# Altium project RX_test_01.PrjPcb (part 3 of 5)

## Sheet IF 2.SchDoc
size A3; SheetNumber: 6; SheetTotal: 13
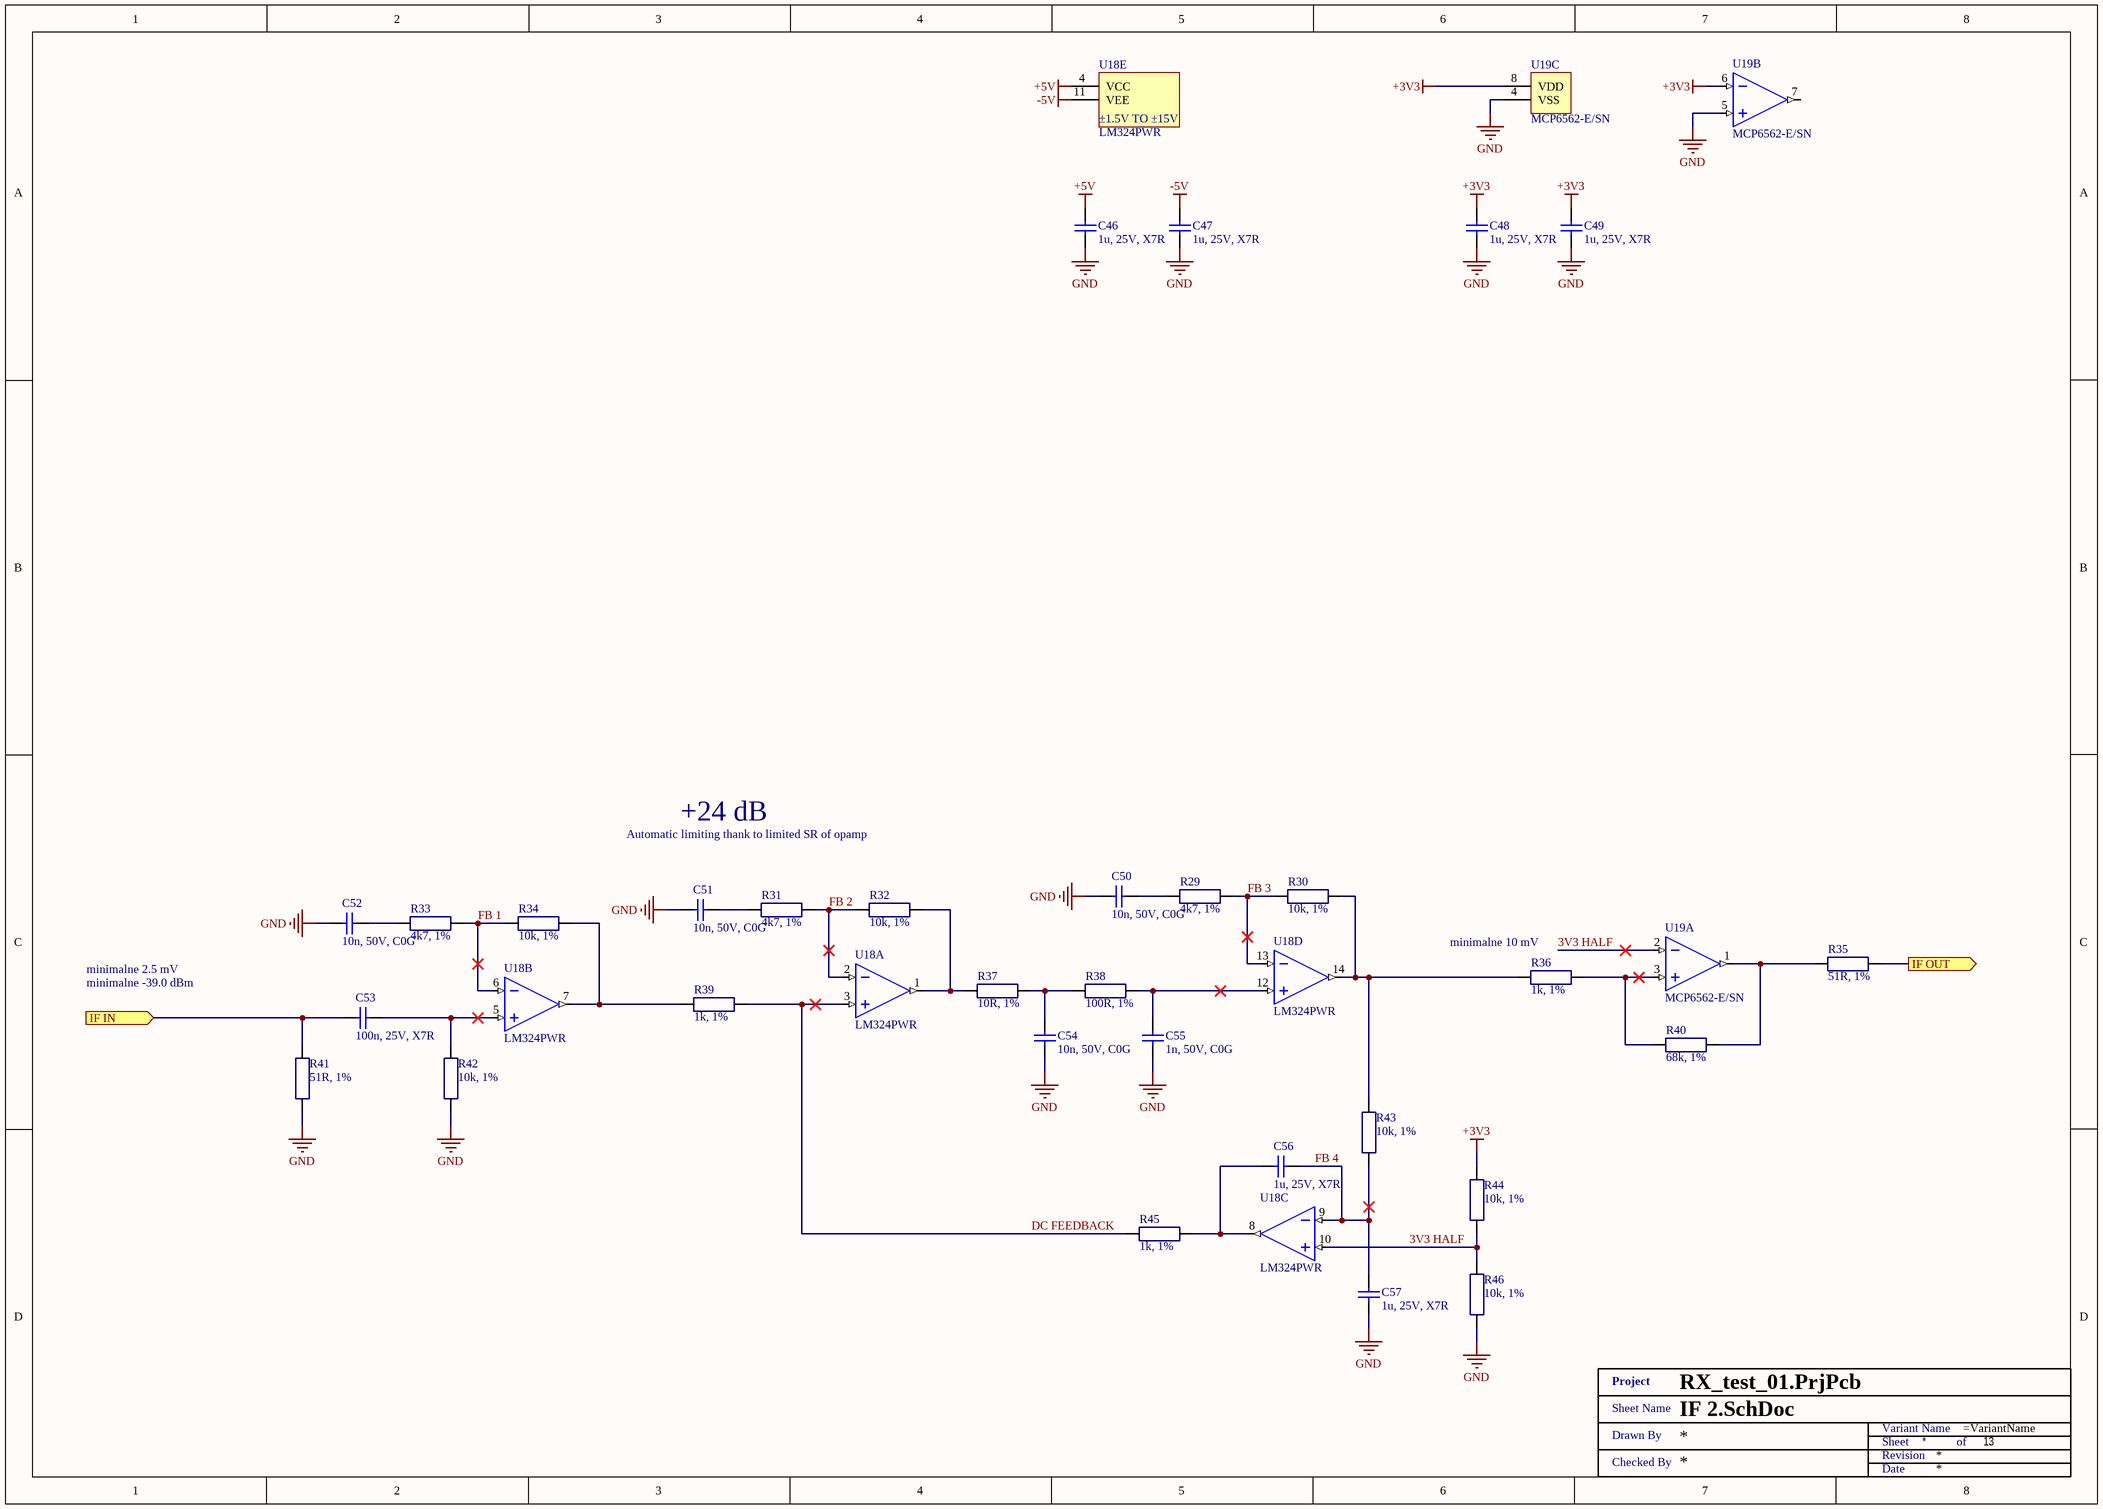
[diagram p5: IF 2.SchDoc]

### Parts
(Parts that share a designator on the sheet are numbered #1, #2 ... from top to bottom, then left to right.)
C46  1u, 25V, X7R  [SMD0603]
C47  1u, 25V, X7R  [SMD0603]
C48  1u, 25V, X7R  [SMD0603]
C49  1u, 25V, X7R  [SMD0603]
C50  10n, 50V, C0G  [SMD0603]
C51  10n, 50V, C0G  [SMD0603]
C52  10n, 50V, C0G  [SMD0603]
C53  100n, 25V, X7R  [SMD0603]
C54  10n, 50V, C0G  [SMD0603]
C55  1n, 50V, C0G  [SMD0603]
C56  1u, 25V, X7R  [SMD0603]
C57  1u, 25V, X7R  [SMD0603]
R29  4k7, 1%  [SMD0603 - R]
R30  10k, 1%  [SMD0603 - R]
R31  4k7, 1%  [SMD0603 - R]
R32  10k, 1%  [SMD0603 - R]
R33  4k7, 1%  [SMD0603 - R]
R34  10k, 1%  [SMD0603 - R]
R35  51R, 1%  [SMD0603 - R]
R36  1k, 1%  [SMD0603 - R]
R37  10R, 1%  [SMD0603 - R]
R38  100R, 1%  [SMD0603 - R]
R39  1k, 1%  [SMD0603 - R]
R40  68k, 1%  [SMD0603 - R]
R41  51R, 1%  [SMD0603 - R]
R42  10k, 1%  [SMD0603 - R]
R43  10k, 1%  [SMD0603 - R]
R44  10k, 1%  [SMD0603 - R]
R45  1k, 1%  [SMD0603 - R]
R46  10k, 1%  [SMD0603 - R]
U18  LM324PWR  [TSSOP14]  (parts A,B,C,D,E of 5)
U19  MCP6562-E/SN  [SOIC08]  (parts A,B,C of 3)
XX?#6  Title 1  (value not drawn)  (graphical)

### Ports
IF IN (in), IF OUT (out)

### Nets
+3V3: C48.2 C49.2 R44.2 U19.6(INB-) U19.8(VDD)
+5V: C46.2 U18.4(VCC)
-5V: C47.2 U18.11(VEE)
GND: C46.1 C47.1 C48.1 C49.1 C50.1 C51.1 C52.1 C54.1 C55.1 C57.1 R41.1 R42.1 R46.1 U19.4(VSS) U19.5(INB+)
3V3 HALF: R44.1 R46.2 U18.10(+IN_C) U19.2(INA-)
DC FEEDBACK: R39.2 R45.1 U18.3(+IN_A)
FB 1: R33.2 R34.1 U18.6(-IN_B)
FB 2: R31.2 R32.1 U18.2(-IN_A)
FB 3: R29.2 R30.1 U18.13(-IN_D)
FB 4: C56.1 C57.2 R43.1 U18.9(-IN_C)
NetC50_2: C50.2 R29.1
NetC51_2: C51.2 R31.1
NetC52_2: C52.2 R33.1
NetC53_1: C53.1 R41.2 ; port IF IN
NetC53_2: C53.2 R42.2 U18.5(+IN_B)
NetC54_2: C54.2 R37.2 R38.1
NetC55_2: C55.2 R38.2 U18.12(+IN_D)
NetC56_2: C56.2 R45.2 U18.8(OUT_C)
NetJ14_2: R35.2 ; port IF OUT
NetR30_2: R30.2 R36.1 R43.2 U18.14(OUT_D)
NetR32_2: R32.2 R37.1 U18.1(OUT_A)
NetR34_2: R34.2 R39.1 U18.7(OUT_B)
NetR35_1: R35.1 R40.2 U19.1(OUTA)
NetR36_2: R36.2 R40.1 U19.3(INA+)

Not connected (* = marked no-connect by the designer): U19 7(OUTB)

### Notes on the sheet
- Automatic limiting thank to limited SR of opamp
- +24 dB
- minimalne 2.5 mV
- minimalne -39.0 dBm
- (near R36) minimalne 10 mV
- (in symbol LM324PWR, part E) ±1.5V TO ±15V
- (in symbol Title 1) Project; Sheet Name; Variant Name; Drawn By; Sheet; of; Revision; Checked By; Date

### Library data of the parts
C46-C49 C56 C57 = CGA3E1X7R1E105K080AC: CAP CER 1UF 25V X7R 0603; Manufacturer: TDK Corporation; Tolerance: ±10%; Manufacturer Part Number: CGA3E1X7R1E105K080AC; RoHS: RoHS Compliant; Category: Capacitors; Stock 1: 109509; Pricing 1: 1=0.2, 10=0.135, 100=0.0686, 500=0.04696, 1000=0.04154 (USD); Packaging: Cut Tape (CT); Part Status: Active; Voltage - Rated: 25V; Temperature Coefficient: X7R; Operating Temperature: -55°C ~ 125°C; Features: -; Ratings: AEC-Q200; Applications: Automotive; Failure Rate: -; Mounting Type: Surface Mount, MLCC; Package / Case: 0603 (1608 Metric); Size / Dimension: 0.063" L x 0.032" W (1.60mm x 0.80mm); Height - Seated (Max): -; Thickness (Max): 0.035" (0.90mm); Lead Spacing: -; Lead Style: -; ComponentLink1URL: https://product.tdk.com/info/en/catalog/datasheets/mlcc_automotive_general_en.pdf; ComponentLink1Description: https://product.tdk.com/info/en/catalog/datasheets/mlcc_automotive_general_en.pdf; Capacitance: 1u; Supplier 1: Mouser; Supplier Part Number 1: 810-CGA3E1X7R1E105K; Supplier 2: Farnell; Supplier Part Number 2: 2346962; Supplier 3: Digi-Key; Supplier Part Number 3: 445-6931-1-ND
C50-C52 C54 = GRM1885C1H103JA01D: Multilayer Ceramic Capacitors MLCC - SMD/SMT 0603 50VDC 10000pF 5% C0G; Manufacturer: Murata Electronics; Type: Chip Multilayer Ceramic Capacitor for General Purpose; Capacitance - nF: 10 nF; Class: Class 1; CNHTS: 8532241000; Dielectric: C0G (NP0); TARIC: 8532240000; Supplier 1: Mouser; Supplier Part Number 1: 81-GRM1885C1H103JA1D; Manufacturer Part Number: GRM1885C1H103JA01D; RoHS: RoHS Compliant; Category: Multilayer Ceramic Capacitors MLCC - SMD/SMT; Stock 1: 217291; Pricing 1: 1=0.183, 10=0.129, 100=0.065, 500=0.045, 1000=0.039, 4000=0.030, 8000=0.027, 24000=0.025 (EUR); Capacitance: 10n; Height: 0.8 mm; Length: 1.6 mm; Package / Case: 0603 (1608 metric); Packaging: Cut Tape; Product: General Type MLCCs; Series: GRM; Termination Style: SMD/SMT; Tolerance: 5 %; Voltage Rating DC: 50 VDC; Width: 0.8 mm; Brand: Murata Electronics; Capacitance - pF: 10000 pF; Case Code - in: 0603; Case Code - mm: 1608; HTS Code: 8532240020; Maximum Operating Temperature: + 125 C; Minimum Operating Temperature: - 55 C; Product Type: Ceramic Capacitors; Standard Pack Qty: 4000; Subcategory: Capacitors; Termination: Standard; RoHS - Mouser: Y; Minimum Order Quantity: 1; Reeling: True; ComponentLink1URL: http://www.mouser.com/datasheet/2/281/murata_03052018_GRM_Series_1-1310166.pdf; ComponentLink1Description: http://www.mouser.com/datasheet/2/281/murata_03052018_GRM_Series_1-1310166.pdf; Supplier 2: Farnell; Supplier Part Number 2: 2456107
C53 = 06033C104KAT2A: AVX - 06033C104KAT2A - CAP, MLCC, X7R, 0.1UF, 25V, 0603; Ceramic Capacitor Case: 0603 [1608 Metric]; Voltage Rating: 25; Capacitance Tolerance: ± 10%; Dielectric Characteristic: X7; Product Range: AVX 0603 MLCC; SVHC: No SVHC (17-Dec-2015)<!--FANDB--><div class="features-and-benefits-container"><div class="features-and-benefits-desc-container"><span class="features-and-benefits-container-desc">SMD Multilayer Ceramic Capacitor, 0603 [1608 Metric], 0.1 µF, 25 V, ± 10%, X7R, AVX 0603 MLCC</span></div><div class="features-and-benefits-description"><span class="features-benefits-value">The 06033C104KAT2A is a SMD Multilayer Ceramic Capacitor with Ni/Sn-plated termination, X7R dielectric and 0603 case. X7R formulations are called temperature stable ceramics and fall into EIA class II materials. X7R is the most popular of this intermediate dielectric constant material. This capacitance change is non-linear. Capacitance for X7R varies under the influence of electrical operating conditions such as voltage and frequency. X7; Supplier 1: Farnell; Supplier Part Number 1: 2530141; Manufacturer: AVX; Manufacturer Part Number: 06033C104KAT2A; RoHS: YES; Stock 1: 22809; Pricing 1: 10=0.012, 100=0.0096, 500=0.0069, 1000=0.006, 2000=0.0048, 4000=0.0038, 20000=0.0027, 40000=0.0026 (GBP); Capacitance: 100n; Packaging: Cut Tape; Operating Temperature Min: -55; Operating Temperature Max: 125; Automotive Qualification Standard: -; MSL: MSL 1 - Unlimited; ComponentLink1URL: http://www.farnell.com/datasheets/2237835.pdf; ComponentLink1Description: http://www.farnell.com/datasheets/2237835.pdf; Supplier 2: Digi-Key; Supplier Part Number 2: 478-3714-1-ND
C55 = MCU0603C102JCT: MULTICOMP - MCU0603C102JCT - CAP, MLCC, C0G/NP0, 1NF, 50V, 0603; Ceramic Capacitor Case: 0603 [1608 Metric]; Voltage Rating: 50; Capacitance Tolerance: ± 5%; Product Range: MCU Series; SVHC: No SVHC (07-Jul-2017); Capacitance Tolerance +: 5%; Capacitor Terminals: SMD; External Depth: 0.8; External Length / Height: 1.6; No. of Pins: 2; Reel Quantity: 4000; Temperature Coefficient: 0ppm/°C ± 30; Voltage Rating V DC: 50V<!--FANDB--><div class="features-and-benefits-container"><div class="features-and-benefits-desc-container"><span class="features-and-benefits-container-desc">SMD Multilayer Ceramic Capacitor, 0603 [1608 Metric], 1000 pF, 50 V, ± 5%, C0G / NP0; Supplier 1: Farnell; Supplier Part Number 1: 9406131; Manufacturer: MULTICOMP; Manufacturer Part Number: MCU0603C102JCT; RoHS: YES; Stock 1: 25831; Pricing 1: 10=0.0164, 100=0.0133, 500=0.0095, 1000=0.0082, 2000=0.0065 (GBP); Capacitance: 1n; Dielectric Characteristic: C0G / NP0; Packaging: Cut Tape; Operating Temperature Min: -55; Operating Temperature Max: 125; Automotive Qualification Standard: -; MSL: -; Capacitance Tolerance ±: ± 5%; External Width: 0.8; Operating Temperature Range: -55°C to +125; Tape Width: 8; Tolerance +: 5%; Tolerance -: 5%; ComponentLink1URL: http://www.farnell.com/datasheets/1723231.pdf; ComponentLink1Description: http://www.farnell.com/datasheets/1723231.pdf
R29 R31 R33 = AC0603FR-074K7L: RES SMD 4.7K OHM 1% 1/10W 0603; Manufacturer: Yageo; Power (Watts): 0.1W, 1/10W; Temperature Coefficient: ±100ppm/°C; Manufacturer Part Number: AC0603FR-074K7L; RoHS: RoHS Compliant; Category: Resistors; Stock 1: 391581; Pricing 1: 1=0.1, 10=0.025, 100=0.01, 1000=0.00448, 2500=0.00389 (USD); Packaging: Cut Tape (CT); Part Status: Active; Tolerance: ±1%; Composition: Thick Film; Features: Automotive AEC-Q200, Moisture Resistant; Operating Temperature: -55°C ~ 155°C; Package / Case: 0603 (1608 Metric); Supplier Device Package: 0603; Size / Dimension: 0.063" L x 0.032" W (1.60mm x 0.80mm); Height - Seated (Max): 0.022" (0.55mm); Failure Rate: -; ComponentLink1URL: http://www.yageo.com/NewPortal/yageodocoutput?fileName=/pdf/R-Chip/PYu-AC_51_RoHS_L_6.pdf; ComponentLink1Description: http://www.yageo.com/NewPortal/yageodocoutput?fileName=/pdf/R-Chip/PYu-AC_51_RoHS_L_6.pdf; Resistance: 4k7; Supplier 1: Mouser; Supplier Part Number 1: 603-AC0603FR-074K7L; Supplier 2: Digi-Key; Supplier Part Number 2: YAG3613CT-ND; Supplier 3: Future Electronics; Supplier Part Number 3: AC0603FR-074K7L-CUTT
R30 R32 R34 R42-R44 R46 = RC0603FR-0710KL: YAGEO (PHYCOMP) - RC0603FR-0710KL - RES, THICK FILM, 10K, 1%, 0.1W, 0603; Voltage Rating: 50; Resistor Case Style: 0603 [1608 Metric]; Power Rating: 100; Product Range: RC Series; Temperature Coefficient: ± 100; SVHC: No SVHC (20-Jun-2016); Manufacturer: YAGEO (PHYCOMP); Manufacturer Part Number: RC0603FR-0710KL; RoHS: YES; Stock 1: 9995; Pricing 1: 5000=0.0025, 25000=0.0014, 50000=0.0013 (GBP); Resistance: 10k; Resistance Tolerance: ± 1%; Packaging: Tape & Reel; Resistor Element Material: Thick Film; Automotive Qualification Standard: -; MSL: MSL 1 - Unlimited<!--FANDB--><div class="features-and-benefits-container"><div class="features-and-benefits-desc-container"><span class="features-and-benefits-container-desc">SMD Chip Resistor, Thick Film, 10 kohm, 50 V, 0603 [1608 Metric], 100 mW, ± 1; ComponentLink1URL: http://past.yageo.com/pdf/PYu-R_Packing_6.pdf; ComponentLink1Description: http://past.yageo.com/pdf/PYu-R_Packing_6.pdf; ComponentLink2URL: http://www.farnell.com/datasheets/2167052.pdf; ComponentLink2Description: http://www.farnell.com/datasheets/2167052.pdf; Supplier 1: Mouser; Supplier Part Number 1: 603-RC0603FR-0710KL; Supplier 2: Farnell; Supplier Part Number 2: 2421850; Supplier 3: Digi-Key; Supplier Part Number 3: 311-10.0KHRCT-ND
R35 R41 = CRCW060351R0FKEA: RES SMD 51 OHM 1% 1/10W 0603; Manufacturer: Vishay Dale; Power (Watts): 0.1W, 1/10W; Temperature Coefficient: ±100ppm/°C; Manufacturer Part Number: CRCW060351R0FKEA; RoHS: RoHS Compliant; Category: Resistors; Stock 1: 21691; Pricing 1: 1=0.1, 10=0.042, 100=0.017, 1000=0.00764, 2500=0.00663 (USD); Packaging: Cut Tape (CT); Part Status: Active; Tolerance: ±1%; Composition: Thick Film; Features: Automotive AEC-Q200; Operating Temperature: -55°C ~ 155°C; Package / Case: 0603 (1608 Metric); Supplier Device Package: 0603; Size / Dimension: 0.063" L x 0.033" W (1.60mm x 0.85mm); Height - Seated (Max): 0.020" (0.50mm); Failure Rate: -; ComponentLink1URL: http://www.vishay.com/docs/20035/dcrcwe3.pdf; ComponentLink1Description: http://www.vishay.com/docs/20035/dcrcwe3.pdf; Resistance: 51R; Supplier 1: Mouser; Supplier Part Number 1: 71-CRCW0603-51-E3; Supplier 2: Farnell; Supplier Part Number 2: 1652889; Supplier 3: Digi-Key; Supplier Part Number 3: 541-51.0HCT-ND
R36 R39 R45 = MCWR06X1001FTL: MULTICOMP - MCWR06X1001FTL - RES, THICK FILM, 1K, 1%, 0.1W, 0603; Voltage Rating: 50; Resistor Case Style: 0603 [1608 Metric]; Power Rating: 100; Product Range: MCWR Series; Temperature Coefficient: ± 100; SVHC: No SVHC (07-Jul-2017)<!--FANDB--><div class="features-and-benefits-container"><div class="features-and-benefits-desc-container"><span class="features-and-benefits-container-desc">SMD Chip Resistor, Thick Film, 1 kohm, 50 V, 0603 [1608 Metric], 100 mW, ± 1; Manufacturer: MULTICOMP; Manufacturer Part Number: MCWR06X1001FTL; RoHS: Y-EX; Stock 1: 134740; Pricing 1: 10=0.0037, 100=0.0022, 500=0.0016, 1000=0.0012, 2500=0.001 (GBP); Resistance: 1k; Resistance Tolerance: ± 1%; Packaging: Cut Tape; Resistor Element Material: Thick Film; Automotive Qualification Standard: -; ComponentLink1URL: http://www.farnell.com/datasheets/1849611.pdf; ComponentLink1Description: http://www.farnell.com/datasheets/1849611.pdf; Supplier 1: Farnell; Supplier Part Number 1: 2447272; Supplier 2: Newark; Supplier Part Number 2: 94X1378
R37 = CRCW060310R0FKEAC: D11/CRCW0603-C 100 10R 1%; Manufacturer: Vishay Dale; Power (Watts): 0.1W, 1/10W; Temperature Coefficient: ±100ppm/°C; Manufacturer Part Number: CRCW060310R0FKEAC; RoHS: RoHS Compliant; Category: Resistors; Stock 1: 49728; Pricing 1: 1=0.1, 10=0.027, 100=0.0108, 1000=0.00487, 2500=0.00422 (USD); Packaging: Cut Tape (CT); Part Status: Active; Tolerance: ±1%; Composition: Thick Film; Features: -; Operating Temperature: -55°C ~ 155°C; Package / Case: 0603 (1608 Metric); Supplier Device Package: 0603; Height - Seated (Max): 0.022" (0.55mm); Failure Rate: -; ComponentLink1URL: http://www.vishay.com/docs/28773/crcwce3.pdf; ComponentLink1Description: http://www.vishay.com/docs/28773/crcwce3.pdf; Resistance: 10R; Supplier 1: Mouser; Supplier Part Number 1: 71-CRCW060310R0FKEAC; Supplier 2: Digi-Key; Supplier Part Number 2: 541-3952-1-ND
R38 = MCWR06X1000FTL: MULTICOMP - MCWR06X1000FTL - RES, THICK FILM, 100R, 1%, 0.1W, 0603; Voltage Rating: 50; Resistor Case Style: 0603 [1608 Metric]; Power Rating: 100; Product Range: MCWR Series; Temperature Coefficient: ± 100; SVHC: No SVHC (07-Jul-2017)<!--FANDB--><div class="features-and-benefits-container"><div class="features-and-benefits-desc-container"><span class="features-and-benefits-container-desc">SMD Chip Resistor, Thick Film, 100 ohm, 50 V, 0603 [1608 Metric], 100 mW, ± 1%, MCWR Series</span></div><div class="features-and-benefits-description"><span class="features-benefits-value">The MCWR06X1000FTL is a thick film Chip Resistor with 0603 chip format. The resistor is constructed in a high grade ceramic body (aluminium oxide). Internal metal electrodes are added at each end and connected by a resistive paste that is applied to the top surface of the substrate. The composition of the paste is adjusted to give the approximate resistance required and the value is trimmed to within tolerance by laser cutting of this resistive layer.</span></div><div class="features-and-benefits-list"><ul class="features-and-benefits-list-list"><li class="features-and-benefits-list-item">High reliability and stability</li><li class="features-and-benefits-list-item">Reduced size of final equipment</li><li class="features-and-benefits-list-item">Lower assembly costs</li><li class="features-and-benefits-list-item">Higher component and equipment reliability</li></ul></div><div class="features-and-benefits-applications"><ul class="features-and-benefits-value"><li class="features-and-benefits-list-item">Consumer Electronics</li><li class="features-and-benefits-list-item">Computers & Computer Peripherals</li><li class="features-and-benefits-list-item">Communications & Networking</li></ul></div></div>; Supplier 1: Farnell; Supplier Part Number 1: 2447227; Manufacturer: MULTICOMP; Manufacturer Part Number: MCWR06X1000FTL; RoHS: Y-EX; Stock 1: 246691; Pricing 1: 10=0.0032, 100=0.002, 500=0.0013, 1000=0.0011, 2500=0.0009 (GBP); Resistance: 100R; Resistance Tolerance: ± 1%; Packaging: Cut Tape; Resistor Element Material: Thick Film; Automotive Qualification Standard: -; ComponentLink1URL: http://www.farnell.com/datasheets/1849611.pdf; ComponentLink1Description: http://www.farnell.com/datasheets/1849611.pdf
R40 = RC0603FR-0768KL: RES SMD 68K OHM 1% 1/10W 0603; Manufacturer: Yageo; Power (Watts): 0.1W, 1/10W; Temperature Coefficient: ±100ppm/°C; Manufacturer Part Number: RC0603FR-0768KL; RoHS: RoHS Compliant; Category: Resistors; Stock 1: 1240858; Pricing 1: 1=0.1, 10=0.015, 100=0.006, 1000=0.00268, 2500=0.00233 (USD); Packaging: Cut Tape (CT); Part Status: Active; Tolerance: ±1%; Composition: Thick Film; Features: Moisture Resistant; Operating Temperature: -55°C ~ 155°C; Package / Case: 0603 (1608 Metric); Supplier Device Package: 0603; Size / Dimension: 0.063" L x 0.032" W (1.60mm x 0.80mm); Height - Seated (Max): 0.022" (0.55mm); Failure Rate: -; ComponentLink1URL: http://www.yageo.com/documents/recent/PYu-RC_Group_51_RoHS_L_8.pdf; ComponentLink1Description: http://www.yageo.com/documents/recent/PYu-RC_Group_51_RoHS_L_8.pdf; Resistance: 68k; Supplier 1: Mouser; Supplier Part Number 1: 603-RC0603FR-0768KL; Supplier 2: Farnell; Supplier Part Number 2: 9238700; Supplier 3: Digi-Key; Supplier Part Number 3: 311-68.0KHRCT-ND
U18 = LM324PWR: OP-AMP, 1.2MHZ, 0.5V/ US, TSSOP-14; Manufacturer: TEXAS INSTRUMENTS; Bandwidth: 1.2; No. of Amplifiers: 4; Slew Rate: 0.5; Supply Voltage Range: ± 1.5V to ± 16; Amplifier Case Style: TSSOP; No. of Pins: 14; SVHC: No SVHC (17-Dec-2014); Filter Terminals: SMD; Input Bias Current: 250000; Op Amp Type: High Gain; Output Current: 20; Quiescent Current: 0.3; Supply Voltage Max: 32; Supply Voltage Min: 3; Parameter 1: Jellybean; Manufacturer Part Number: LM324PWR; RoHS: YES; Stock 1: 1889; Pricing 1: 5=0,171, 50=0,15, 250=0,126, 500=0,125, 1000=0,125 (EUR); Operating Temperature Min: 0; Operating Temperature Max: 70; Packaging: Cut Tape; MSL: MSL 1 - Unlimited; Amplifer Supply Voltage: ± 1.5V to ± 16; Operating Temperature Range: 0°C to +70; ComponentLink1URL: http://www.farnell.com/datasheets/1877076.pdf; ComponentLink1Description: http://www.farnell.com/datasheets/1877076.pdf; Stock 3: 1204; Pricing 3: 1=0,24, 10=0,23, 100=0,23, 250=0,22, 500=0,21, 1000=0,21, 3000=0,171, 10000=0,157 (EUR); ComponentLink2URL: http://www.farnell.com/datasheets/378369.pdf; ComponentLink2Description: http://www.farnell.com/datasheets/378369.pdf; Supplier 1: Mouser; Supplier 2: Farnell; Supplier Part Number 2: 2342289; Supplier Part Number 1: 595-LM324PWR
U19 = MCP6562-E/SN: Microchip MCP6562-E/SN Dual Comparator, Push-Pull O/P, 3 V, 5 V 8-Pin SOIC; Max Supply Voltage: 5.5V; Min Supply Voltage: 1.8V; Common Mode Rejection Ratio: 66dB; Number of Channels: 2; Nominal Supply Current: 130uA; Propagation Delay: 80ns; Input Offset Voltage (Vos): 10mV; Input Bias Current: 1pA; Output Current: 50mA; Hysteresis: 5mV; Turn-On Delay Time: 45ns; Power Supply Rejection Ratio (PSRR): 70dB; Natural Thermal Resistance: 163°C/W; Response Time: 49ns; Output Type: TTL,PUSH-PULL; Supplier 1: Mouser; Supplier Part Number 1: 579-MCP6562-E/SN; Manufacturer: Microchip; Manufacturer Part Number: MCP6562-E/SN; RoHS: Yes; Category: Comparators; Stock 1: 2727; Pricing 1: 1=0.85000, 10=0.84800, 25=0.71100, 50=0.71100, 100=0.65900, 1000=0.65900, 10000=0.65900 (USD); Mount: Surface Mount; Case/Package: SOIC; Number of Pins: 8; Min Operating Temperature: -40°C; Max Operating Temperature: 125°C; Packaging: Rail/Tube; Number of Elements: 2; Package Quantity: 100; Quiescent Current: 130uA; Max Supply Current: 130uA; Type: General Purpose; Supply Current: 130uA; Technology: CMOS; Length: 4.9mm; Width: 3.9mm; Height: 1.25mm; Radiation Hardening: No; REACH SVHC: No SVHC; Lead Free: Lead Free; RoHS Compliant: Yes; ComponentLink1URL: https://datasheet.ciiva.com/1576/22139b-1576720.pdf?src-supplier=Newark; ComponentLink1Description: https://datasheet.ciiva.com/1576/22139b-1576720.pdf?src-supplier=Newark; ComponentLink2URL: https://datasheet.ciiva.com/15131/getdatasheetpartid-771954-15131482.pdf?src-supplier=Verical; ComponentLink2Description: https://datasheet.ciiva.com/15131/getdatasheetpartid-771954-15131482.pdf?src-supplier=Verical; ComponentLink3URL: https://datasheet.ciiva.com/26344/651517-da-01-en-ic-comp-mcp6562-e-sn-soic-8n-mcp-26344456.pdf?src-supplier=Conrad; ComponentLink3Description: https://datasheet.ciiva.com/26344/651517-da-01-en-ic-comp-mcp6562-e-sn-soic-8n-mcp-26344456.pdf?src-supplier=Conrad; ComponentLink4URL: https://datasheet.ciiva.com/1483/630456-1483745.pdf?src-supplier=Element14; ComponentLink4Description: https://datasheet.ciiva.com/1483/630456-1483745.pdf?src-supplier=Element14; ComponentLink5URL: https://datasheet.ciiva.com/2971/jp540574-2971157.pdf?src-supplier=Avnet; ComponentLink5Description: https://datasheet.ciiva.com/2971/jp540574-2971157.pdf?src-supplier=Avnet; ComponentLink6URL: https://datasheet.ciiva.com/16450/filehandler-aspxddocname-en540574-16450650.pdf?src-supplier=Future+Electronics; ComponentLink6Description: https://datasheet.ciiva.com/16450/filehandler-aspxddocname-en540574-16450650.pdf?src-supplier=Future+Electronics; ComponentLink7URL: https://datasheet.ciiva.com/1828/22139b-1828444.pdf?src-supplier=Digi-Key; ComponentLink7Description: https://datasheet.ciiva.com/1828/22139b-1828444.pdf?src-supplier=Digi-Key; ComponentLink8URL: https://datasheet.ciiva.com/17548/jp540574-17548718.pdf?src-supplier=Avnet+Europe; ComponentLink8Description: https://datasheet.ciiva.com/17548/jp540574-17548718.pdf?src-supplier=Avnet+Europe; ComponentLink9URL: https://datasheet.ciiva.com/12288/22139a-12288079.pdf?src-supplier=Mouser; ComponentLink9Description: https://datasheet.ciiva.com/12288/22139a-12288079.pdf?src-supplier=Mouser; Supplier 2: Farnell; Supplier Part Number 2: 1715875; Supplier 3: RSComponents; Supplier Part Number 3: 6696275

## Sheet DETECTOR.SchDoc
size A4; SheetNumber: 7; SheetTotal: 13
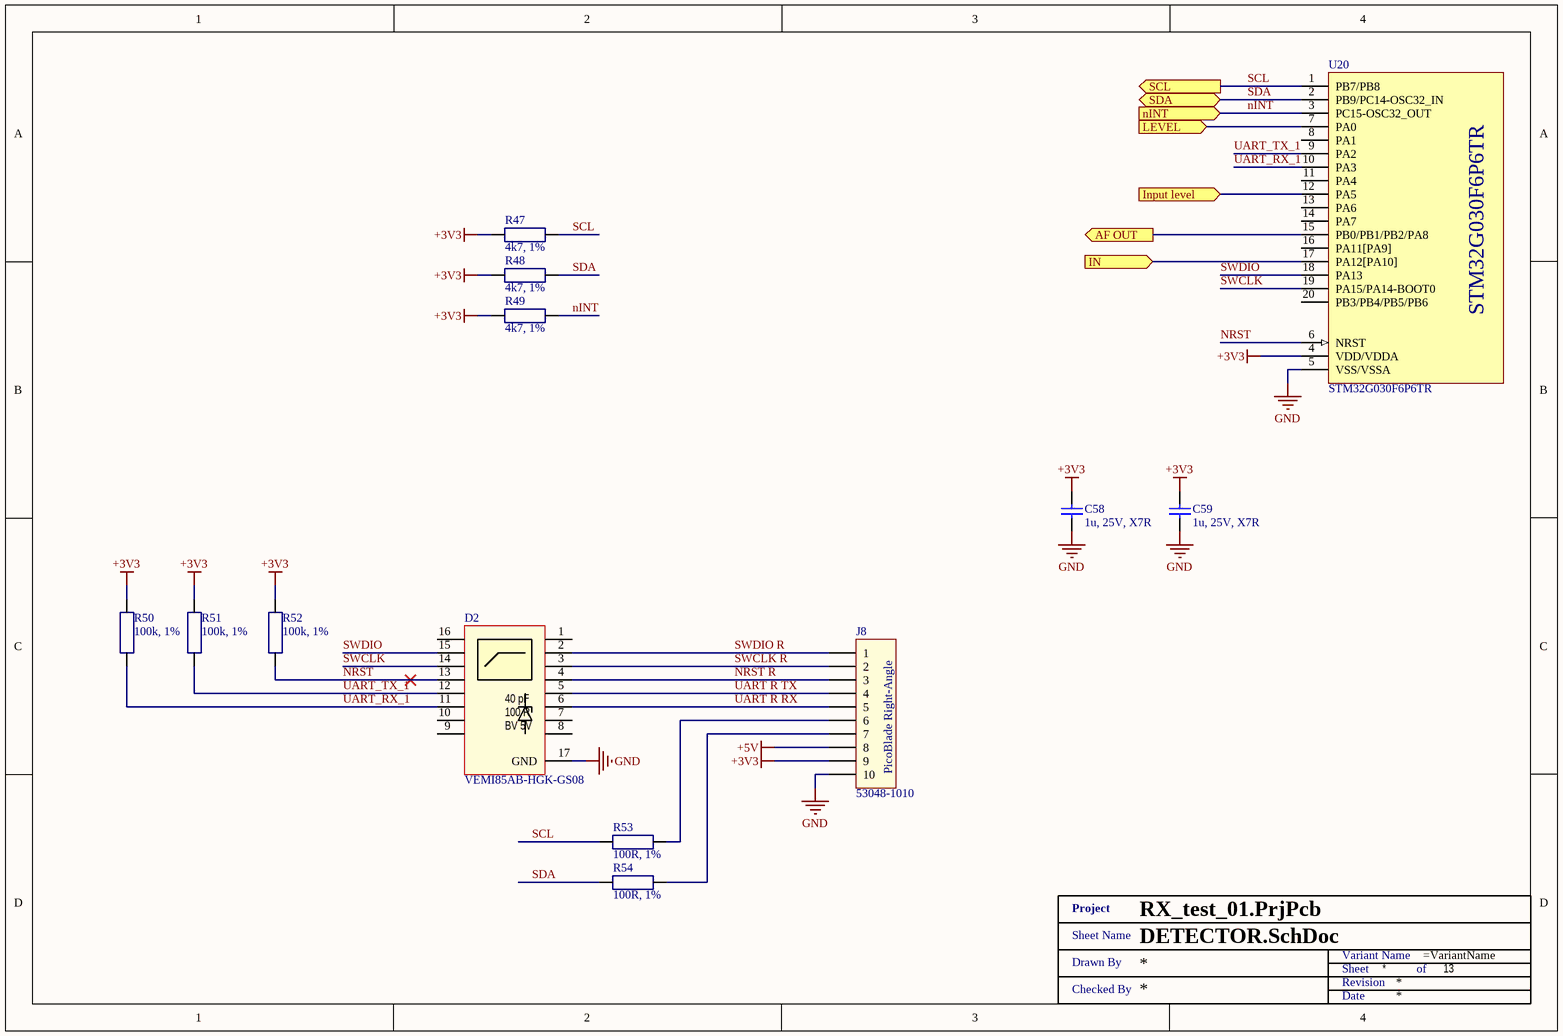
[diagram p6: DETECTOR.SchDoc]

### Parts
(Parts that share a designator on the sheet are numbered #1, #2 ... from top to bottom, then left to right.)
C58  1u, 25V, X7R  [SMD0603]
C59  1u, 25V, X7R  [SMD0603]
D2  VEMI85AB-HGK-GS08  [LLP3313-17L]
J8  53048-1010  [530481010]
R47  4k7, 1%  [SMD0603 - R]
R48  4k7, 1%  [SMD0603 - R]
R49  4k7, 1%  [SMD0603 - R]
R50  100k, 1%  [SMD0603 - R]
R51  100k, 1%  [SMD0603 - R]
R52  100k, 1%  [SMD0603 - R]
R53  100R, 1%  [SMD0603 - R]
R54  100R, 1%  [SMD0603 - R]
U20  STM32G030F6P6TR  [TSSOP20]
XX?#7  Title 1  (value not drawn)  (graphical)

### Ports
AF OUT (out), IN (in), Input level (in), LEVEL (in), nINT (in), SCL (out), SDA (bidir)

### Nets
+3V3: C58.2 C59.2 J8.9 R47.1 R48.1 R49.1 R50.2 R51.2 R52.2 U20.4(VDD/VDDA)
+5V: J8.8
GND: C58.1 C59.1 D2.17(GND) J8.10 U20.5(VSS/VSSA)
nINT: R49.2 U20.3(PC15-OSC32_OUT) ; port nINT
NRST: D2.13 R52.1 U20.6(NRST)
NRST R: D2.4 J8.3
SCL: R47.2 R53.1 U20.1(PB7/PB8) ; port SCL
SDA: R48.2 R54.1 U20.2(PB9/PC14-OSC32_IN) ; port SDA
SWCLK: D2.14 U20.19(PA15/PA14-BOOT0)
SWCLK R: D2.3 J8.2
SWDIO: D2.15 U20.18(PA13)
SWDIO R: D2.2 J8.1
UART R RX: D2.6 J8.5
UART R TX: D2.5 J8.4
UART_RX_1: D2.11 R50.1 U20.10(PA3)
UART_TX_1: D2.12 R51.1 U20.9(PA2)
NetD17_2: U20.12(PA5) ; port Input level
NetD18_2: U20.7(PA0) ; port LEVEL
NetJ8_6: J8.6 R53.2
NetJ8_7: J8.7 R54.2
NetJ14_3: U20.17(PA12[PA10]) ; port IN
NetJ15_2: U20.15(PB0/PB1/PB2/PA8) ; port AF OUT

Not connected (* = marked no-connect by the designer): D2 1 7 8 9 10 16; U20 8(PA1) 11(PA4) 13(PA6) 14(PA7) 16(PA11[PA9]) 20(PB3/PB4/PB5/PB6)

### Notes on the sheet
- (in symbol 53048-1010) PicoBlade Right-Angle
- (in symbol Title 1) Project; Sheet Name; Variant Name; Drawn By; Sheet; of; Revision; Checked By; Date
- (in symbol VEMI85AB-HGK-GS08) 40 pF; 100 R; BV 5V

### Library data of the parts
C58 C59 = CGA3E1X7R1E105K080AC: as C46 on sheet IF 2; Manufacturer Part Number: CGA3E1X7R1E105K080AC; RoHS: RoHS Compliant; Category: Capacitors; Stock 1: 109509; Pricing 1: 1=0.2, 10=0.135, 100=0.0686, 500=0.04696, 1000=0.04154 (USD); Packaging: Cut Tape (CT); Part Status: Active; Voltage - Rated: 25V; Temperature Coefficient: X7R; Operating Temperature: -55°C ~ 125°C; Features: -; Ratings: AEC-Q200; Applications: Automotive; Failure Rate: -; Mounting Type: Surface Mount, MLCC; Package / Case: 0603 (1608 Metric); Size / Dimension: 0.063" L x 0.032" W (1.60mm x 0.80mm); Height - Seated (Max): -; Thickness (Max): 0.035" (0.90mm); Lead Spacing: -; Lead Style: -; ComponentLink1URL: https://product.tdk.com/info/en/catalog/datasheets/mlcc_automotive_general_en.pdf; ComponentLink1Description: https://product.tdk.com/info/en/catalog/datasheets/mlcc_automotive_general_en.pdf; Capacitance: 1u; Supplier 1: Mouser; Supplier Part Number 1: 810-CGA3E1X7R1E105K; Supplier 2: Farnell; Supplier Part Number 2: 2346962; Supplier 3: Digi-Key; Supplier Part Number 3: 445-6931-1-ND
D2 = VEMI85AB-HGK-GS08: EMI FILTER; Manufacturer: VISHAY; EMI Filter Type: EMI Filter with ESD Protection; No. of Data Lines: 8 Data Lines; Filter Circuit: C-R-C Pi Filter; Filter Case Style: LLP3313; No. of Pins: 17; Clamping Voltage Vc Max: 8; Supplier 1: Mouser; Supplier Part Number 1: 78-VEMI85AB-HGK; Manufacturer Part Number: VEMI85AB-HGK-GS08; RoHS: YES; Stock 1: 9416; Pricing 1: 1=0.563, 25=0.446, 50=0.393, 100=0.339, 250=0.308, 500=0.279 (GBP); Product Range: -; ComponentLink1URL: http://www.farnell.com/datasheets/2244016.pdf; ComponentLink1Description: http://www.farnell.com/datasheets/2244016.pdf; Supplier 2: Farnell; Supplier Part Number 2: 1795412; Supplier 3: Digi-Key; Supplier Part Number 3: 751-1456-2-ND
J8 = 53048-1010: 1.25mm Pitch, PicoBlade PCB Header, Single Row, Right-Angle, Through Hole, Tin (Sn) Plating, Friction Lock, 10 Circuits, Tray, 2.30mm PC Tail Length; Manufacturer: Molex, LLC; Pitch - Mating: 0.049" (1.25mm); Number of Positions: 10; Number of Positions Loaded: All; Style: Board to Cable/Wire; Shrouding: Shrouded - 4 Wall; Contact Length - Post: 0.091" (2.30mm); Material Flammability Rating: UL94 V-0; Manufacturer Part Number: 53048-1010; RoHS: RoHS Compliant; Category: Connectors, Interconnects; Stock 1: 6090; Pricing 1: 1=0.87, 10=0.763, 100=0.6582, 500=0.53856, 1000=0.47872, 5000=0.41888, 10000=0.39794 (USD); Packaging: Tray; Part Status: Active; Connector Type: Header; Contact Type: Male Blade; Number of Rows: 1; Row Spacing - Mating: -; Mounting Type: Through Hole, Right Angle; Termination: Solder; Fastening Type: Detent Lock; Contact Length - Mating: -; Overall Contact Length: -; Insulation Height: 0.138" (3.50mm); Contact Shape: Rectangular; Contact Finish - Mating: Tin; Contact Finish Thickness - Mating: -; Contact Finish - Post: Tin; Contact Material: Phosphor Bronze; Insulation Material: Polyamide (PA), Nylon; Features: -; Operating Temperature: -; Ingress Protection: -; Insulation Color: Natural; Current Rating: -; Voltage Rating: -; Mated Stacking Heights: -; Contact Finish Thickness - Post: -; Applications: Automotive, General Purpose, Industrial, Medical; ComponentLink1URL: http://www.molex.com/pdm_docs/sd/530481010_sd.pdf; ComponentLink1Description: http://www.molex.com/pdm_docs/sd/530481010_sd.pdf; Ucel: Ucel; Supplier 1: Mouser; Supplier Part Number 1: 538-53048-1010; Supplier 2: Digi-Key; Supplier Part Number 2: WM1750-ND; Supplier 3: Farnell; Supplier Part Number 3: 9733108
R47-R49 = CRCW06034K70FKEA: RES SMD 4.7K OHM 1% 1/10W 0603; Manufacturer: Vishay Dale; Power (Watts): 0.1W, 1/10W; Temperature Coefficient: ±100ppm/°C; Manufacturer Part Number: CRCW06034K70FKEA; RoHS: RoHS Compliant; Category: Resistors; Stock 1: 0; Pricing 1: 1=0.1, 10=0.042, 100=0.017, 1000=0.00764, 2500=0.00663 (USD); Packaging: Cut Tape (CT); Part Status: Active; Tolerance: ±1%; Composition: Thick Film; Features: Automotive AEC-Q200; Operating Temperature: -55°C ~ 155°C; Package / Case: 0603 (1608 Metric); Supplier Device Package: 0603; Size / Dimension: 0.063" L x 0.033" W (1.60mm x 0.85mm); Height - Seated (Max): 0.020" (0.50mm); Failure Rate: -; ComponentLink1URL: http://www.vishay.com/docs/20035/dcrcwe3.pdf; ComponentLink1Description: http://www.vishay.com/docs/20035/dcrcwe3.pdf; Resistance: 4k7; Supplier 1: Mouser; Supplier Part Number 1: 71-CRCW0603-4.7K-E3; Supplier 2: Farnell; Supplier Part Number 2: 1469807; Supplier 3: Digi-Key; Supplier Part Number 3: 541-4.70KHCT-ND
R50-R52 = RC0603FR-07100KL: RES SMD 100K OHM 1% 1/10W 0603; Manufacturer: Yageo; Power (Watts): 0.1W, 1/10W; Temperature Coefficient: ±100ppm/°C; Manufacturer Part Number: RC0603FR-07100KL; RoHS: RoHS Compliant; Category: Resistors; Stock 1: 14618646; Pricing 1: 1=0.1, 10=0.015, 100=0.006, 1000=0.00268, 2500=0.00233 (USD); Packaging: Cut Tape (CT); Part Status: Active; Tolerance: ±1%; Composition: Thick Film; Features: Moisture Resistant; Operating Temperature: -55°C ~ 155°C; Package / Case: 0603 (1608 Metric); Supplier Device Package: 0603; Size / Dimension: 0.063" L x 0.032" W (1.60mm x 0.80mm); Height - Seated (Max): 0.022" (0.55mm); Failure Rate: -; ComponentLink1URL: http://www.yageo.com/documents/recent/PYu-RC_Group_51_RoHS_L_8.pdf; ComponentLink1Description: http://www.yageo.com/documents/recent/PYu-RC_Group_51_RoHS_L_8.pdf; Resistance: 100k; Supplier 1: Mouser; Supplier Part Number 1: 603-RC0603FR-07100KL; Supplier 2: Farnell; Supplier Part Number 2: 9238727; Supplier 3: Digi-Key; Supplier Part Number 3: 311-100KHRCT-ND
R53 R54 = MCWR06X1000FTL: as R38 on sheet IF 2; Supplier 1: Farnell; Supplier Part Number 1: 2447227; Manufacturer: MULTICOMP; Manufacturer Part Number: MCWR06X1000FTL; RoHS: Y-EX; Stock 1: 246691; Pricing 1: 10=0.0032, 100=0.002, 500=0.0013, 1000=0.0011, 2500=0.0009 (GBP); Resistance: 100R; Resistance Tolerance: ± 1%; Packaging: Cut Tape; Resistor Element Material: Thick Film; Automotive Qualification Standard: -; ComponentLink1URL: http://www.farnell.com/datasheets/1849611.pdf; ComponentLink1Description: http://www.farnell.com/datasheets/1849611.pdf
U20 = STM32G030F6P6TR: MCU 32-Bit STM32 ARM Cortex-M0+ RISC 32KB Flash 2V to 3.6V 20-Pin TSSOP T/R; Manufacturer: STMicroelectronics; Supplier 1: Mouser; Supplier Part Number 1: 511-STM32G030F6P6TR; Manufacturer Part Number: STM32G030F6P6TR; RoHS: Yes; Category: Microcontrollers; Stock 1: 3310; Pricing 1: 1=1.84000, 10=1.66000, 50=1.66000, 100=1.29000, 250=1.21000, 500=1.07000, 1000=0.84100, 2500=0.78400, 5000=0.74700, 10000=0.74700 (USD); Supplier 2: Digi-Key; Supplier Part Number 2: 497-STM32G030F6P6TRCT-ND

## Sheet AF AMP.SchDoc
size A4; SheetNumber: 8; SheetTotal: 12
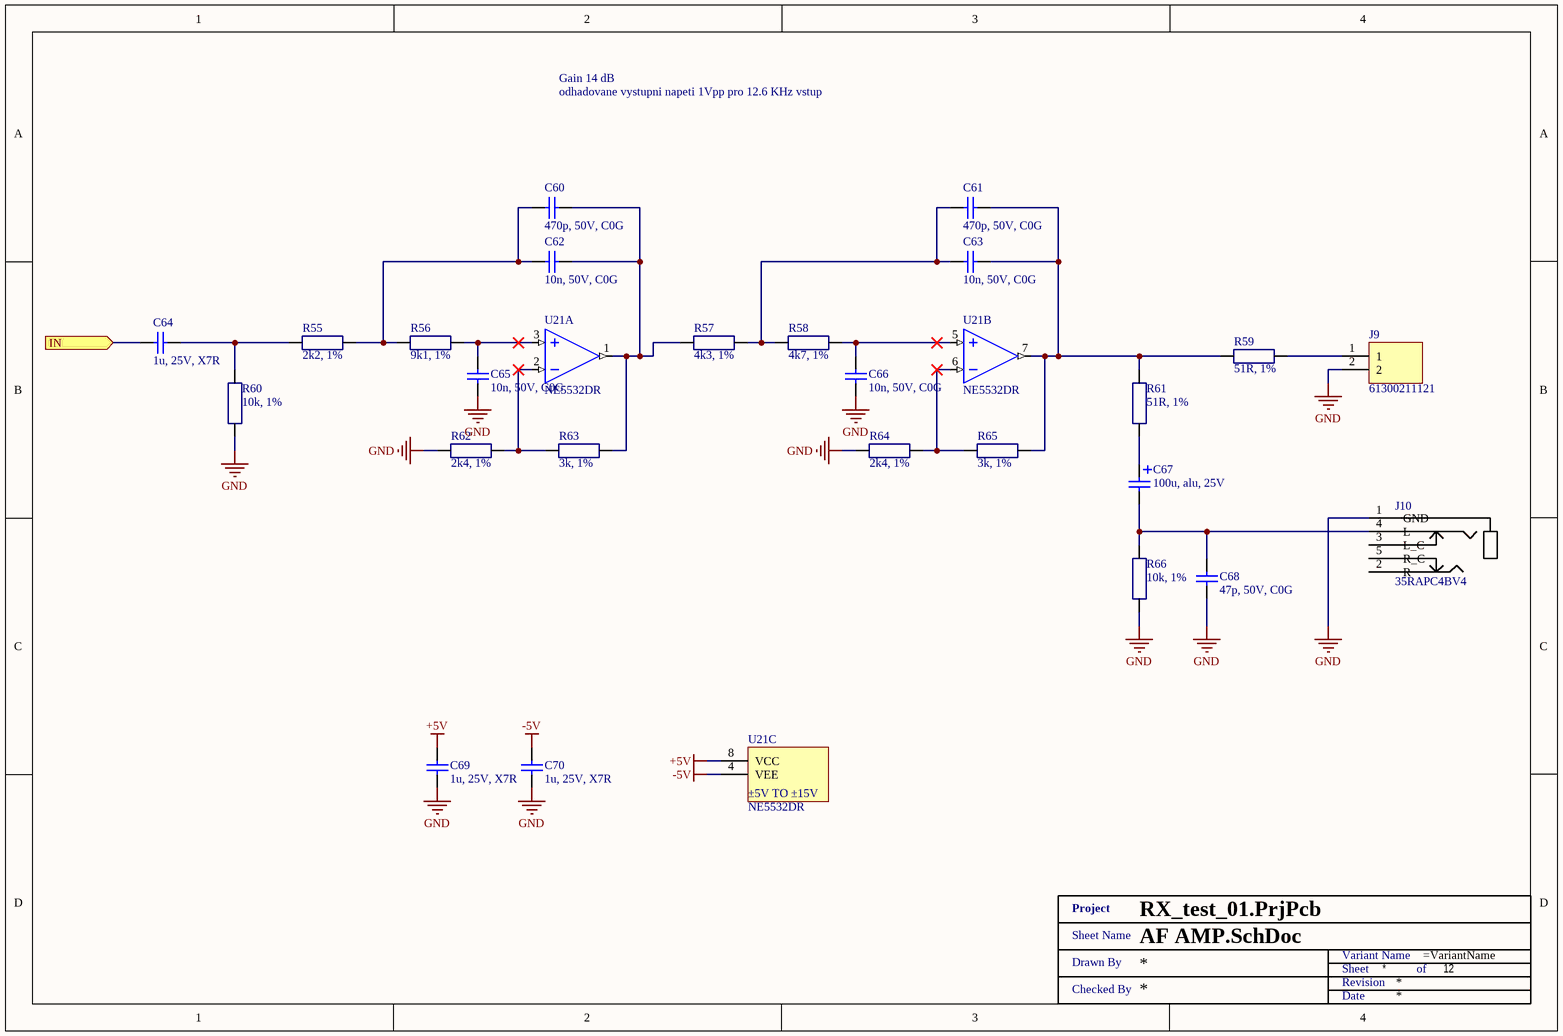
[diagram p7: AF AMP.SchDoc]

### Parts
(Parts that share a designator on the sheet are numbered #1, #2 ... from top to bottom, then left to right.)
C60  470p, 50V, C0G  [SMD0603]
C61  470p, 50V, C0G  [SMD0603]
C62  10n, 50V, C0G  [SMD0603]
C63  10n, 50V, C0G  [SMD0603]
C64  1u, 25V, X7R  [SMD0603]
C65  10n, 50V, C0G  [SMD0603]
C66  10n, 50V, C0G  [SMD0603]
C67  100u, alu, 25V  [WCAP-ATLI_6.3x11x2.5]
C68  47p, 50V, C0G  [SMD0603]
C69  1u, 25V, X7R  [SMD0603]
C70  1u, 25V, X7R  [SMD0603]
J9  61300211121  [Header 2 2.54mm]
J10  35RAPC4BV4  [35RAPC4BV4]
R55  2k2, 1%  [SMD0603 - R]
R56  9k1, 1%  [SMD0603 - R]
R57  4k3, 1%  [SMD0603 - R]
R58  4k7, 1%  [SMD0603 - R]
R59  51R, 1%  [SMD0603 - R]
R60  10k, 1%  [SMD0603 - R]
R61  51R, 1%  [SMD0603 - R]
R62  2k4, 1%  [SMD0603 - R]
R63  3k, 1%  [SMD0603 - R]
R64  2k4, 1%  [SMD0603 - R]
R65  3k, 1%  [SMD0603 - R]
R66  10k, 1%  [SMD0603 - R]
U21  NE5532DR  [SOIC08]  (parts A,B,C of 3)
XX?#8  Title 1  (value not drawn)  (graphical)

### Ports
IN (in)

### Nets
+5V: C69.2 U21.8(VCC)
-5V: C70.2 U21.4(VEE)
GND: C65.1 C66.1 C68.1 C69.1 C70.1 J9.2 J10.1(GND) R60.1 R62.1 R64.1 R66.1
NetC60_1: C60.1 C62.2 R55.2 R56.1
NetC60_2: C60.2 C62.1 R57.1 R63.2 U21.1(OUT_A)
NetC61_1: C61.1 C63.2 R57.2 R58.1
NetC61_2: C61.2 C63.1 R59.1 R61.2 R65.2 U21.7(OUT_B)
NetC64_1: C64.1 ; port IN
NetC64_2: C64.2 R55.1 R60.2
NetC65_2: C65.2 R56.2 U21.3(+IN_A)
NetC66_2: C66.2 R58.2 U21.5(+IN_B)
NetC67_1: C67.1 R61.1
NetC67_2: C67.2 C68.2 J10.4(L) R66.2
NetJ9_1: J9.1 R59.2
NetR62_2: R62.2 R63.1 U21.2(-IN_A)
NetR64_2: R64.2 R65.1 U21.6(-IN_B)

Not connected (* = marked no-connect by the designer): J10 2(R) 3(L_C) 5(R_C)

### Notes on the sheet
- Gain 14 dB
- odhadovane vystupni napeti 1Vpp pro 12.6 KHz vstup
- (in symbol NE5532DR, part C) ±5V TO ±15V
- (in symbol Title 1) Project; Sheet Name; Variant Name; Drawn By; Sheet; of; Revision; Checked By; Date

### Library data of the parts
C60 C61 = GCM1885C1H471JA16D: MURATA - GCM1885C1H471JA16D - CAP, MLCC, C0G/NP0, 470PF, 50V, 0603; Ceramic Capacitor Case: 0603 [1608 Metric]; Voltage Rating: 50; Capacitance Tolerance: ± 5%; Product Range: GCM Series; SVHC: No SVHC (17-Dec-2015)<!--FANDB--><div class="features-and-benefits-container"><div class="features-and-benefits-desc-container"><span class="features-and-benefits-container-desc">SMD Multilayer Ceramic Capacitor, 0603 [1608 Metric], 470 pF, 50 V, ± 5%, C0G / NP0, GCM Series</span></div><div class="features-and-benefits-description"><span class="features-benefits-value">The GCM series capacitors from Murata are automotive grade multilayer ceramic chip capacitors (MLCC) used for automotive applications such as power train and safety equipment. The safety equipment includes drive system control, air bags and ABS of engine ECU. These MLCC capacitors are classified into temperature compensating and high dielectric constant types depending on the change in electrostatic capacitance due to change in temperature. The temperature compensating capacitors feature a small rate of change in electrostatic capacitance as the temperature changes. The high dielectric constant capacitors use materials with a high dielectric constant and feature a large electrostatic capacitance.</span></div><div class="features-and-benefits-list"><ul class="features-and-benefits-list-list"><li class="features-and-benefits-list-item">Capacitance values ranges from 0.1pF to 47?F</li><li class="features-and-benefits-list-item">Large capacity and small size in a multilayer structure</li><li class="features-and-benefits-list-item">Tin plated external electrodes, excellent solderability</li><li class="features-and-benefits-list-item">Capacitor size varies from 0.6mm x 0.3mm to 5.7mm x 5.0mm</li><li class="features-and-benefits-list-item">Voltage rating ranges from 6.3VDC to 1000VDC</li><li class="features-and-benefits-list-item">Temperature characteristics are classified according to JIS and EIA standard</li><li class="features-and-benefits-list-item">Operating temperature changes according to temperature coefficient of capacitor</li><li class="features-and-benefits-list-item">Automotive grade AEC-Q200 qualified</li></ul></div><div class="features-and-benefits-applications"><ul class="features-and-benefits-value"><li class="features-and-benefits-list-item">Industrial</li><li class="features-and-benefits-list-item">Consumer Electronics</li><li class="features-and-benefits-list-item">Portable Devices</li><li class="features-and-benefits-list-item">Power Management</li><li class="features-and-benefits-list-item">Safety</li><li class="features-and-benefits-list-item">Automotive</li></ul></div></div>; Supplier 1: Farnell; Supplier Part Number 1: 2494192; Manufacturer: MURATA; Manufacturer Part Number: GCM1885C1H471JA16D; RoHS: YES; Stock 1: 10240; Pricing 1: 10=0.0277, 100=0.0184, 500=0.0139, 1000=0.0111, 2000=0.0103, 4000=0.0091, 20000=0.0077, 40000=0.0071 (GBP); Capacitance: 470p; Dielectric Characteristic: C0G / NP0; Packaging: Cut Tape; Operating Temperature Min: -55; Operating Temperature Max: 125; Automotive Qualification Standard: -; MSL: MSL 6 - Time on Label; ComponentLink1URL: http://www.farnell.com/datasheets/1955642.pdf; ComponentLink1Description: http://www.farnell.com/datasheets/1955642.pdf; Supplier 2: Digi-Key; Supplier Part Number 2: 490-4965-1-ND
C62 C63 C65 C66 = GRM1885C1H103JA01D: as C50 on sheet IF 2; Supplier 1: Mouser; Supplier Part Number 1: 81-GRM1885C1H103JA1D; Manufacturer Part Number: GRM1885C1H103JA01D; RoHS: RoHS Compliant; Category: Multilayer Ceramic Capacitors MLCC - SMD/SMT; Stock 1: 217291; Pricing 1: 1=0.183, 10=0.129, 100=0.065, 500=0.045, 1000=0.039, 4000=0.030, 8000=0.027, 24000=0.025 (EUR); Capacitance: 10n; Height: 0.8 mm; Length: 1.6 mm; Package / Case: 0603 (1608 metric); Packaging: Cut Tape; Product: General Type MLCCs; Series: GRM; Termination Style: SMD/SMT; Tolerance: 5 %; Voltage Rating DC: 50 VDC; Width: 0.8 mm; Brand: Murata Electronics; Capacitance - pF: 10000 pF; Case Code - in: 0603; Case Code - mm: 1608; HTS Code: 8532240020; Maximum Operating Temperature: + 125 C; Minimum Operating Temperature: - 55 C; Product Type: Ceramic Capacitors; Standard Pack Qty: 4000; Subcategory: Capacitors; Termination: Standard; RoHS - Mouser: Y; Minimum Order Quantity: 1; Reeling: True; ComponentLink1URL: http://www.mouser.com/datasheet/2/281/murata_03052018_GRM_Series_1-1310166.pdf; ComponentLink1Description: http://www.mouser.com/datasheet/2/281/murata_03052018_GRM_Series_1-1310166.pdf; Supplier 2: Farnell; Supplier Part Number 2: 2456107
C64 C69 C70 = CGA3E1X7R1E105K080AC: as C46 on sheet IF 2; Manufacturer Part Number: CGA3E1X7R1E105K080AC; RoHS: RoHS Compliant; Category: Capacitors; Stock 1: 109509; Pricing 1: 1=0.2, 10=0.135, 100=0.0686, 500=0.04696, 1000=0.04154 (USD); Packaging: Cut Tape (CT); Part Status: Active; Voltage - Rated: 25V; Temperature Coefficient: X7R; Operating Temperature: -55°C ~ 125°C; Features: -; Ratings: AEC-Q200; Applications: Automotive; Failure Rate: -; Mounting Type: Surface Mount, MLCC; Package / Case: 0603 (1608 Metric); Size / Dimension: 0.063" L x 0.032" W (1.60mm x 0.80mm); Height - Seated (Max): -; Thickness (Max): 0.035" (0.90mm); Lead Spacing: -; Lead Style: -; ComponentLink1URL: https://product.tdk.com/info/en/catalog/datasheets/mlcc_automotive_general_en.pdf; ComponentLink1Description: https://product.tdk.com/info/en/catalog/datasheets/mlcc_automotive_general_en.pdf; Capacitance: 1u; Supplier 1: Mouser; Supplier Part Number 1: 810-CGA3E1X7R1E105K; Supplier 2: Farnell; Supplier Part Number 2: 2346962; Supplier 3: Digi-Key; Supplier Part Number 3: 445-6931-1-ND
C67 = 860010473007: CAP 100 UF 20% 25 V; Manufacturer: Wurth Electronics; Material: Aluminium; Capacitance: 100uF; Polarity: Polar; Ripple Current: 209mA; Life (Hours): 2000Hour; Supplier 1: Mouser; Supplier Part Number 1: 710-860010473007; Manufacturer Part Number: 860010473007; RoHS: Yes; Category: Aluminum Electrolytic Capacitors; Stock 1: 1494; Pricing 1: 1=0.14000, 10=0.13400, 25=0.13400, 50=0.11200, 100=0.09800, 250=0.08700 (USD); Mount: Through Hole; Case/Package: Radial; Min Operating Temperature: -40°C; Max Operating Temperature: 85°C; Tolerance: 20%; Voltage Rating (DC): 25V; Package Quantity: 1500; Packaging: Tape and Reel; Voltage Rating: 25V; Diameter: 6.3mm; Height: 11mm; Lead Pitch: 0.098inch; Height - Seated (Max): 0.492inch; REACH SVHC: Unknown; ComponentLink1URL: https://datasheet.ciiva.com/48693/001280151-da-01-en-wcap-atg8-alu-elec-caps-860010473007-48693591.pdf?src-supplier=Conrad; ComponentLink1Description: https://datasheet.ciiva.com/48693/001280151-da-01-en-wcap-atg8-alu-elec-caps-860010473007-48693591.pdf?src-supplier=Conrad; Supplier 2: Farnell; Supplier Part Number 2: 2465675; Supplier 3: Digi-Key; Supplier Part Number 3: 732-8630-1-ND
C68 = C0603C470J5GACAUTO: CAP CER 47PF 50V C0G/NP0 0603; Manufacturer: KEMET; Tolerance: ±5%; Temperature Coefficient: C0G, NP0; Manufacturer Part Number: C0603C470J5GACAUTO; RoHS: RoHS Compliant; Category: Capacitors; Stock 1: 21519; Pricing 1: 1=0.12, 10=0.088, 100=0.0391, 500=0.02792, 1000=0.02193 (USD); Packaging: Cut Tape (CT); Part Status: Active; Voltage - Rated: 50V; Operating Temperature: -55°C ~ 125°C; Features: -; Ratings: AEC-Q200; Applications: Automotive; Failure Rate: -; Mounting Type: Surface Mount, MLCC; Package / Case: 0603 (1608 Metric); Size / Dimension: 0.063" L x 0.032" W (1.60mm x 0.80mm); Height - Seated (Max): -; Thickness (Max): 0.034" (0.87mm); Lead Spacing: -; Lead Style: -; ComponentLink1URL: https://search.kemet.com/component-edge/download/datasheet/C0603C470J5GACAUTO.pdf; ComponentLink1Description: https://search.kemet.com/component-edge/download/datasheet/C0603C470J5GACAUTO.pdf; Capacitance: 47p; Supplier 1: Mouser; Supplier Part Number 1: 80-C0603C470J5G; Supplier 2: Farnell; Supplier Part Number 2: 1414639; Supplier 3: Digi-Key; Supplier Part Number 3: 399-6890-1-ND; Supplier 4: TME; Supplier Part Number 4: C0603C470J5GAC
J9 = 61300211121: CONN HEADER 2 POS 2.54; Manufacturer: Wurth Electronics Inc.; Pitch - Mating: 0.100" (2.54mm); Number of Positions: 2; Number of Positions Loaded: All; Style: Board to Board or Cable; Shrouding: Unshrouded; Contact Length - Mating: 0.236" (6.00mm); Contact Length - Post: 0.118" (3.00mm); Overall Contact Length: 0.454" (11.54mm); Material Flammability Rating: UL94 V-0; Current Rating: 3A; Voltage Rating: 250V; Manufacturer Part Number: 61300211121; RoHS: RoHS Compliant; Category: Connectors, Interconnects; Stock 1: 164911; Pricing 1: 1=0.13, 10=0.106, 25=0.088, 50=0.074, 100=0.067, 1000=0.061 (USD); Packaging: Bulk; Part Status: Active; Connector Type: Header; Contact Type: Male Pin; Number of Rows: 1; Row Spacing - Mating: -; Mounting Type: Through Hole; Termination: Solder; Fastening Type: Push-Pull; Insulation Height: 0.100" (2.54mm); Contact Shape: Square; Contact Finish - Mating: Gold; Contact Finish Thickness - Mating: -; Contact Finish - Post: -; Contact Material: Copper Alloy; Insulation Material: Polybutylene Terephthalate (PBT); Features: -; Operating Temperature: -40°C ~ 125°C; Ingress Protection: -; Insulation Color: Black; Mated Stacking Heights: -; Contact Finish Thickness - Post: -; Applications: -; ComponentLink1URL: https://katalog.we-online.de/em/datasheet/6130xx11121.pdf; ComponentLink1Description: https://katalog.we-online.de/em/datasheet/6130xx11121.pdf; Supplier 1: Mouser; Supplier Part Number 1: 710-61300211121; Supplier 2: Farnell; Supplier Part Number 2: 2356153; Supplier 3: Digi-Key; Supplier Part Number 3: 732-5315-ND
J10 = 35RAPC4BV4: SWITCHCRAFT - 35RAPC4BV4 - CONNECTOR, RCA/PHONO, JACK, 3WAY; No. of Contacts: 3; Pin Diameter: 3.5; Connector Mounting: PCB Mount; Connector Body Material: Plastic Body; SVHC: No SVHC (15-Jun-2015); Connector Colour: Black; Contact Termination: Solder<!--FANDB--><div class="features-and-benefits-container"><div class="features-and-benefits-description"><span class="features-benefits-value">The 35RAPC4BV4 is a 3.5mm Mono and Stereo PC Board Vertical-mount Jack with black PBT+15% glass filled housing, nickel-plated brass bushing, tin-plated phosphor bronze springs and a clear polycarbonate cover. The compact design and an easy of installation onto a PCB make this an ideal solution.</span></div><div class="features-and-benefits-list"><ul class="features-and-benefits-list-list"><li class="features-and-benefits-list-item">5000 cycles Life</li><li class="features-and-benefits-list-item">50; Supplier 1: Farnell; Supplier Part Number 1: 2293877; Manufacturer: SWITCHCRAFT; Manufacturer Part Number: 35RAPC4BV4; RoHS: YES; Stock 1: 216; Pricing 1: 1=1.28, 25=1.11, 50=1.06, 100=1.01, 250=0.975, 500=0.939 (GBP); Gender: Jack; Contact Plating: Tin Plated Contacts; Product Range: -; ComponentLink1URL: http://www.farnell.com/datasheets/921436.pdf; ComponentLink1Description: http://www.farnell.com/datasheets/921436.pdf; Supplier 2: Digi-Key; Supplier Part Number 2: SC1461-ND
R55 = CRCW06032K20FKEA: RES SMD 2.2K OHM 1% 1/10W 0603; Manufacturer: Vishay Dale; Power (Watts): 0.1W, 1/10W; Temperature Coefficient: ±100ppm/°C; Manufacturer Part Number: CRCW06032K20FKEA; RoHS: RoHS Compliant; Category: Resistors; Stock 1: 0; Pricing 1: 1=0.1, 10=0.042, 100=0.017, 1000=0.00764, 2500=0.00663 (USD); Packaging: Cut Tape (CT); Part Status: Active; Tolerance: ±1%; Composition: Thick Film; Features: Automotive AEC-Q200; Operating Temperature: -55°C ~ 155°C; Package / Case: 0603 (1608 Metric); Supplier Device Package: 0603; Size / Dimension: 0.063" L x 0.033" W (1.60mm x 0.85mm); Height - Seated (Max): 0.020" (0.50mm); Failure Rate: -; ComponentLink1URL: http://www.vishay.com/docs/20035/dcrcwe3.pdf; ComponentLink1Description: http://www.vishay.com/docs/20035/dcrcwe3.pdf; Resistance: 2k2; Supplier 1: Mouser; Supplier Part Number 1: 71-CRCW0603-2.2K-E3; Supplier 2: Farnell; Supplier Part Number 2: 1469765; Supplier 3: Digi-Key; Supplier Part Number 3: 541-2.20KHCT-ND; Supplier 4: TME; Supplier Part Number 4: CRCW06032K20FKEA
R56 = RC0603FR-079K1L: RES SMD 9.1K OHM 1% 1/10W 0603; Manufacturer: Yageo; Power (Watts): 0.1W, 1/10W; Temperature Coefficient: ±100ppm/°C; Manufacturer Part Number: RC0603FR-079K1L; RoHS: RoHS Compliant; Category: Resistors; Stock 1: 198170; Pricing 1: 1=0.1, 10=0.015, 100=0.006, 1000=0.00268, 2500=0.00233 (USD); Packaging: Cut Tape (CT); Part Status: Active; Tolerance: ±1%; Composition: Thick Film; Features: Moisture Resistant; Operating Temperature: -55°C ~ 155°C; Package / Case: 0603 (1608 Metric); Supplier Device Package: 0603; Size / Dimension: 0.063" L x 0.032" W (1.60mm x 0.80mm); Height - Seated (Max): 0.022" (0.55mm); Failure Rate: -; ComponentLink1URL: http://www.yageo.com/documents/recent/PYu-RC_Group_51_RoHS_L_8.pdf; ComponentLink1Description: http://www.yageo.com/documents/recent/PYu-RC_Group_51_RoHS_L_8.pdf; Resistance: 9k1; Supplier 1: Mouser; Supplier Part Number 1: 603-RC0603FR-079K1L; Supplier 2: Digi-Key; Supplier Part Number 2: 311-9.10KHRCT-ND; Supplier 3: Arrow; Supplier Part Number 3: RC0603FR-079K1L
R57 = RC0603FR-074K3L: RES SMD 4.3K OHM 1% 1/10W 0603; Manufacturer: Yageo; Power (Watts): 0.1W, 1/10W; Temperature Coefficient: ±100ppm/°C; Manufacturer Part Number: RC0603FR-074K3L; RoHS: RoHS Compliant; Category: Resistors; Stock 1: 600881; Pricing 1: 1=0.1, 10=0.015, 100=0.006, 1000=0.00268, 2500=0.00233 (USD); Packaging: Cut Tape (CT); Part Status: Active; Tolerance: ±1%; Composition: Thick Film; Features: Moisture Resistant; Operating Temperature: -55°C ~ 155°C; Package / Case: 0603 (1608 Metric); Supplier Device Package: 0603; Size / Dimension: 0.063" L x 0.032" W (1.60mm x 0.80mm); Height - Seated (Max): 0.022" (0.55mm); Failure Rate: -; ComponentLink1URL: http://www.yageo.com/documents/recent/PYu-RC_Group_51_RoHS_L_8.pdf; ComponentLink1Description: http://www.yageo.com/documents/recent/PYu-RC_Group_51_RoHS_L_8.pdf; Resistance: 4k3; Supplier 1: Mouser; Supplier Part Number 1: 603-RC0603FR-074K3L; Supplier 2: Digi-Key; Supplier Part Number 2: 311-4.30KHRCT-ND
R58 = AC0603FR-074K7L: as R29 on sheet IF 2; Manufacturer Part Number: AC0603FR-074K7L; RoHS: RoHS Compliant; Category: Resistors; Stock 1: 391581; Pricing 1: 1=0.1, 10=0.025, 100=0.01, 1000=0.00448, 2500=0.00389 (USD); Packaging: Cut Tape (CT); Part Status: Active; Tolerance: ±1%; Composition: Thick Film; Features: Automotive AEC-Q200, Moisture Resistant; Operating Temperature: -55°C ~ 155°C; Package / Case: 0603 (1608 Metric); Supplier Device Package: 0603; Size / Dimension: 0.063" L x 0.032" W (1.60mm x 0.80mm); Height - Seated (Max): 0.022" (0.55mm); Failure Rate: -; ComponentLink1URL: http://www.yageo.com/NewPortal/yageodocoutput?fileName=/pdf/R-Chip/PYu-AC_51_RoHS_L_6.pdf; ComponentLink1Description: http://www.yageo.com/NewPortal/yageodocoutput?fileName=/pdf/R-Chip/PYu-AC_51_RoHS_L_6.pdf; Resistance: 4k7; Supplier 1: Mouser; Supplier Part Number 1: 603-AC0603FR-074K7L; Supplier 2: Digi-Key; Supplier Part Number 2: YAG3613CT-ND; Supplier 3: Future Electronics; Supplier Part Number 3: AC0603FR-074K7L-CUTT
R59 R61 = CRCW060351R0FKEA: as R35 on sheet IF 2; Manufacturer Part Number: CRCW060351R0FKEA; RoHS: RoHS Compliant; Category: Resistors; Stock 1: 21691; Pricing 1: 1=0.1, 10=0.042, 100=0.017, 1000=0.00764, 2500=0.00663 (USD); Packaging: Cut Tape (CT); Part Status: Active; Tolerance: ±1%; Composition: Thick Film; Features: Automotive AEC-Q200; Operating Temperature: -55°C ~ 155°C; Package / Case: 0603 (1608 Metric); Supplier Device Package: 0603; Size / Dimension: 0.063" L x 0.033" W (1.60mm x 0.85mm); Height - Seated (Max): 0.020" (0.50mm); Failure Rate: -; ComponentLink1URL: http://www.vishay.com/docs/20035/dcrcwe3.pdf; ComponentLink1Description: http://www.vishay.com/docs/20035/dcrcwe3.pdf; Resistance: 51R; Supplier 1: Mouser; Supplier Part Number 1: 71-CRCW0603-51-E3; Supplier 2: Farnell; Supplier Part Number 2: 1652889; Supplier 3: Digi-Key; Supplier Part Number 3: 541-51.0HCT-ND
R60 R66 = RC0603FR-0710KL: as R30 on sheet IF 2; Manufacturer: YAGEO (PHYCOMP); Manufacturer Part Number: RC0603FR-0710KL; RoHS: YES; Stock 1: 9995; Pricing 1: 5000=0.0025, 25000=0.0014, 50000=0.0013 (GBP); Resistance: 10k; Resistance Tolerance: ± 1%; Packaging: Tape & Reel; Resistor Element Material: Thick Film; Automotive Qualification Standard: -; MSL: MSL 1 - Unlimited<!--FANDB--><div class="features-and-benefits-container"><div class="features-and-benefits-desc-container"><span class="features-and-benefits-container-desc">SMD Chip Resistor, Thick Film, 10 kohm, 50 V, 0603 [1608 Metric], 100 mW, ± 1; ComponentLink1URL: http://past.yageo.com/pdf/PYu-R_Packing_6.pdf; ComponentLink1Description: http://past.yageo.com/pdf/PYu-R_Packing_6.pdf; ComponentLink2URL: http://www.farnell.com/datasheets/2167052.pdf; ComponentLink2Description: http://www.farnell.com/datasheets/2167052.pdf; Supplier 1: Mouser; Supplier Part Number 1: 603-RC0603FR-0710KL; Supplier 2: Farnell; Supplier Part Number 2: 2421850; Supplier 3: Digi-Key; Supplier Part Number 3: 311-10.0KHRCT-ND
R62 R64 = RC0603FR-072K4L: RES SMD 2.4K OHM 1% 1/10W 0603; Manufacturer: Yageo; Power (Watts): 0.1W, 1/10W; Temperature Coefficient: ±100ppm/°C; Manufacturer Part Number: RC0603FR-072K4L; RoHS: RoHS Compliant; Category: Resistors; Stock 1: 577810; Pricing 1: 1=0.1, 10=0.015, 100=0.006, 1000=0.00268, 2500=0.00233 (USD); Packaging: Cut Tape (CT); Part Status: Active; Tolerance: ±1%; Composition: Thick Film; Features: Moisture Resistant; Operating Temperature: -55°C ~ 155°C; Package / Case: 0603 (1608 Metric); Supplier Device Package: 0603; Size / Dimension: 0.063" L x 0.032" W (1.60mm x 0.80mm); Height - Seated (Max): 0.022" (0.55mm); Failure Rate: -; ComponentLink1URL: http://www.yageo.com/documents/recent/PYu-RC_Group_51_RoHS_L_8.pdf; ComponentLink1Description: http://www.yageo.com/documents/recent/PYu-RC_Group_51_RoHS_L_8.pdf; Resistance: 2k4; Supplier 1: Mouser; Supplier Part Number 1: 603-RC0603FR-072K4L; Supplier 2: Farnell; Supplier Part Number 2: 1799329; Supplier 3: Digi-Key; Supplier Part Number 3: 311-2.40KHRCT-ND
R63 R65 = RC0603FR-073KL: RES SMD 3K OHM 1% 1/10W 0603; Manufacturer: Yageo; Power Rating: 100mW; Voltage Rating: 50V; Temperature Coefficient: 100ppm/°C; Supplier 1: Mouser; Supplier Part Number 1: 603-RC0603FR-073KL; Manufacturer Part Number: RC0603FR-073KL; RoHS: Yes; Category: Chip SMD Resistors; Stock 1: 515955; Pricing 1: 1=0.10000, 10=0.01800, 50=0.01800, 100=0.00600, 1000=0.00500, 10000=0.00300 (USD); Case/Package: 0603; Number of Pins: 2; Case Code (Imperial): 0603; Case Code (Metric): 1608; Size Code: 0603; Min Operating Temperature: -55°C; Max Operating Temperature: 155°C; Tolerance: 1%; Resistance: 3k; Packaging: Tape and Reel; Termination: SMD/SMT; Resistor Type: Thick Film; Voltage Rating (DC): 50V; Features: Moisture Resistant; Series: RC; Max Power Dissipation: 100mW; Number of Terminations: 2; Construction: Rectangular; Resistance Tolerance: 1%; Length: 1.6mm; Width: 800um; Depth: 0.8mm; REACH SVHC: No SVHC; Military Standard: Not; Lead Free: Lead Free; RoHS Compliant: Yes; ComponentLink1URL: http://components.arrow.com/part/dataview/0323_00200942?src-supplier=Arrow+Europe; ComponentLink1Description: http://components.arrow.com/part/dataview/0323_00200942?src-supplier=Arrow+Europe; ComponentLink2URL: http://www.mouser.com/ds/2/447/RC0603-272842.pdf?src-supplier=Mouser; ComponentLink2Description: http://www.mouser.com/ds/2/447/RC0603-272842.pdf?src-supplier=Mouser; ComponentLink3URL: http://www.farnell.com/datasheets/2167052.pdf?src-supplier=Farnell; ComponentLink3Description: http://www.farnell.com/datasheets/2167052.pdf?src-supplier=Farnell; ComponentLink4URL: https://www.verical.com/server-webapp/html/getDatasheet?partID=135099&src-supplier=Verical; ComponentLink4Description: https://www.verical.com/server-webapp/html/getDatasheet?partID=135099&src-supplier=Verical; ComponentLink5URL: http://www.farnell.com/datasheets/2167052.pdf?src-supplier=Element14; ComponentLink5Description: http://www.farnell.com/datasheets/2167052.pdf?src-supplier=Element14; ComponentLink6URL: http://www.farnell.com/datasheets/1868787.pdf?src-supplier=Newark; ComponentLink6Description: http://www.farnell.com/datasheets/1868787.pdf?src-supplier=Newark; ComponentLink7URL: http://www.yageo.com/documents/recent/PYu-RC0603_51_RoHS_L_7.pdf?src-supplier=Future+Electronics; ComponentLink7Description: http://www.yageo.com/documents/recent/PYu-RC0603_51_RoHS_L_7.pdf?src-supplier=Future+Electronics; ComponentLink8URL: http://www.yageo.com/documents/recent/PYu-RC_Group_51_RoHS_L_9.pdf?src-supplier=Digi-Key; ComponentLink8Description: http://www.yageo.com/documents/recent/PYu-RC_Group_51_RoHS_L_9.pdf?src-supplier=Digi-Key; ComponentLink9URL: http://www.yageo.com/documents/recent/PYu-RC_Group_51_RoHS_L_10.pdf?src-supplier=Digi-Key; ComponentLink9Description: http://www.yageo.com/documents/recent/PYu-RC_Group_51_RoHS_L_10.pdf?src-supplier=Digi-Key; Supplier 2: Farnell; Supplier Part Number 2: 3495834; Supplier 3: Digi-Key; Supplier Part Number 3: 311-3.00KHRCT-ND
U21 = NE5532DR: 2-channel, 10-MHz, 26-V output swing, low-noise audio op amp 8-SOIC 0 to 70; Manufacturer: Texas Instruments; Bandwidth: 10MHz; Number of Channels: 2; Voltage Gain: 100dB; Min Dual Supply Voltage: 5V; Max Dual Supply Voltage: 15V; Output Current: 38mA; Nominal Supply Current: 16mA; Common Mode Rejection Ratio: 70dB; Slew Rate: 9V/µs; Max I/O Voltage: 4mV; Input Bias Current: 800nA; Operating Supply Current: 8mA; Dual Supply Voltage: 9V; Parameter 1: Jellybean; Supplier 1: Mouser; Supplier Part Number 1: 595-NE5532DR; Manufacturer Part Number: NE5532DR; RoHS: Yes; Category: Amplifiers - Op Amps, Buffer, Instrumentation; Pricing 1: 1=0.60000, 10=0.51400, 50=0.51400, 100=0.35600, 500=0.30100, 1000=0.23300, 2500=0.21100, 10000=0.21100 (USD); Case/Package: D; Number of Pins: 8; Contact Plating: Gold; Min Operating Temperature: 0°C; Max Operating Temperature: 70°C; Packaging: Tape and Reel; Number of Circuits: 2; Gain Bandwidth Product: 10MHz; Unity Gain Bandwidth Product: 10MHz; Package Quantity: 1; Nominal Gain Bandwidth Product: 10MHz; Input Offset Voltage (Vos): 4mV; Output Current per Channel: 38mA; Number of Elements: 2; Max Supply Voltage: 15V; Number of Amplifiers: 2; Length: 4.9mm; Width: 3.91mm; Height: 1.58mm; Radiation Hardening: No; Lead Free: Lead Free; RoHS Compliant: Yes; REACH SVHC: No SVHC; ComponentLink1URL: https://datasheet.ciiva.com/1796/ne5532-1796190.pdf?src-supplier=Digi-Key; ComponentLink1Description: https://datasheet.ciiva.com/1796/ne5532-1796190.pdf?src-supplier=Digi-Key; ComponentLink2URL: https://datasheet.ciiva.com/1796/ne5532-1796189.pdf?src-supplier=Digi-Key; ComponentLink2Description: https://datasheet.ciiva.com/1796/ne5532-1796189.pdf?src-supplier=Digi-Key; ComponentLink3URL: https://datasheet.ciiva.com/1796/ne5532-1796191.pdf?src-supplier=Digi-Key; ComponentLink3Description: https://datasheet.ciiva.com/1796/ne5532-1796191.pdf?src-supplier=Digi-Key; Supplier 2: Farnell; Supplier Part Number 2: 3117312; Supplier 3: Digi-Key; Supplier Part Number 3: 296-13622-6-ND